# Altium schematic sheet usbhub.SchDoc
size 381 x 241 mm; SheetNumber: 1; SheetTotal: 2
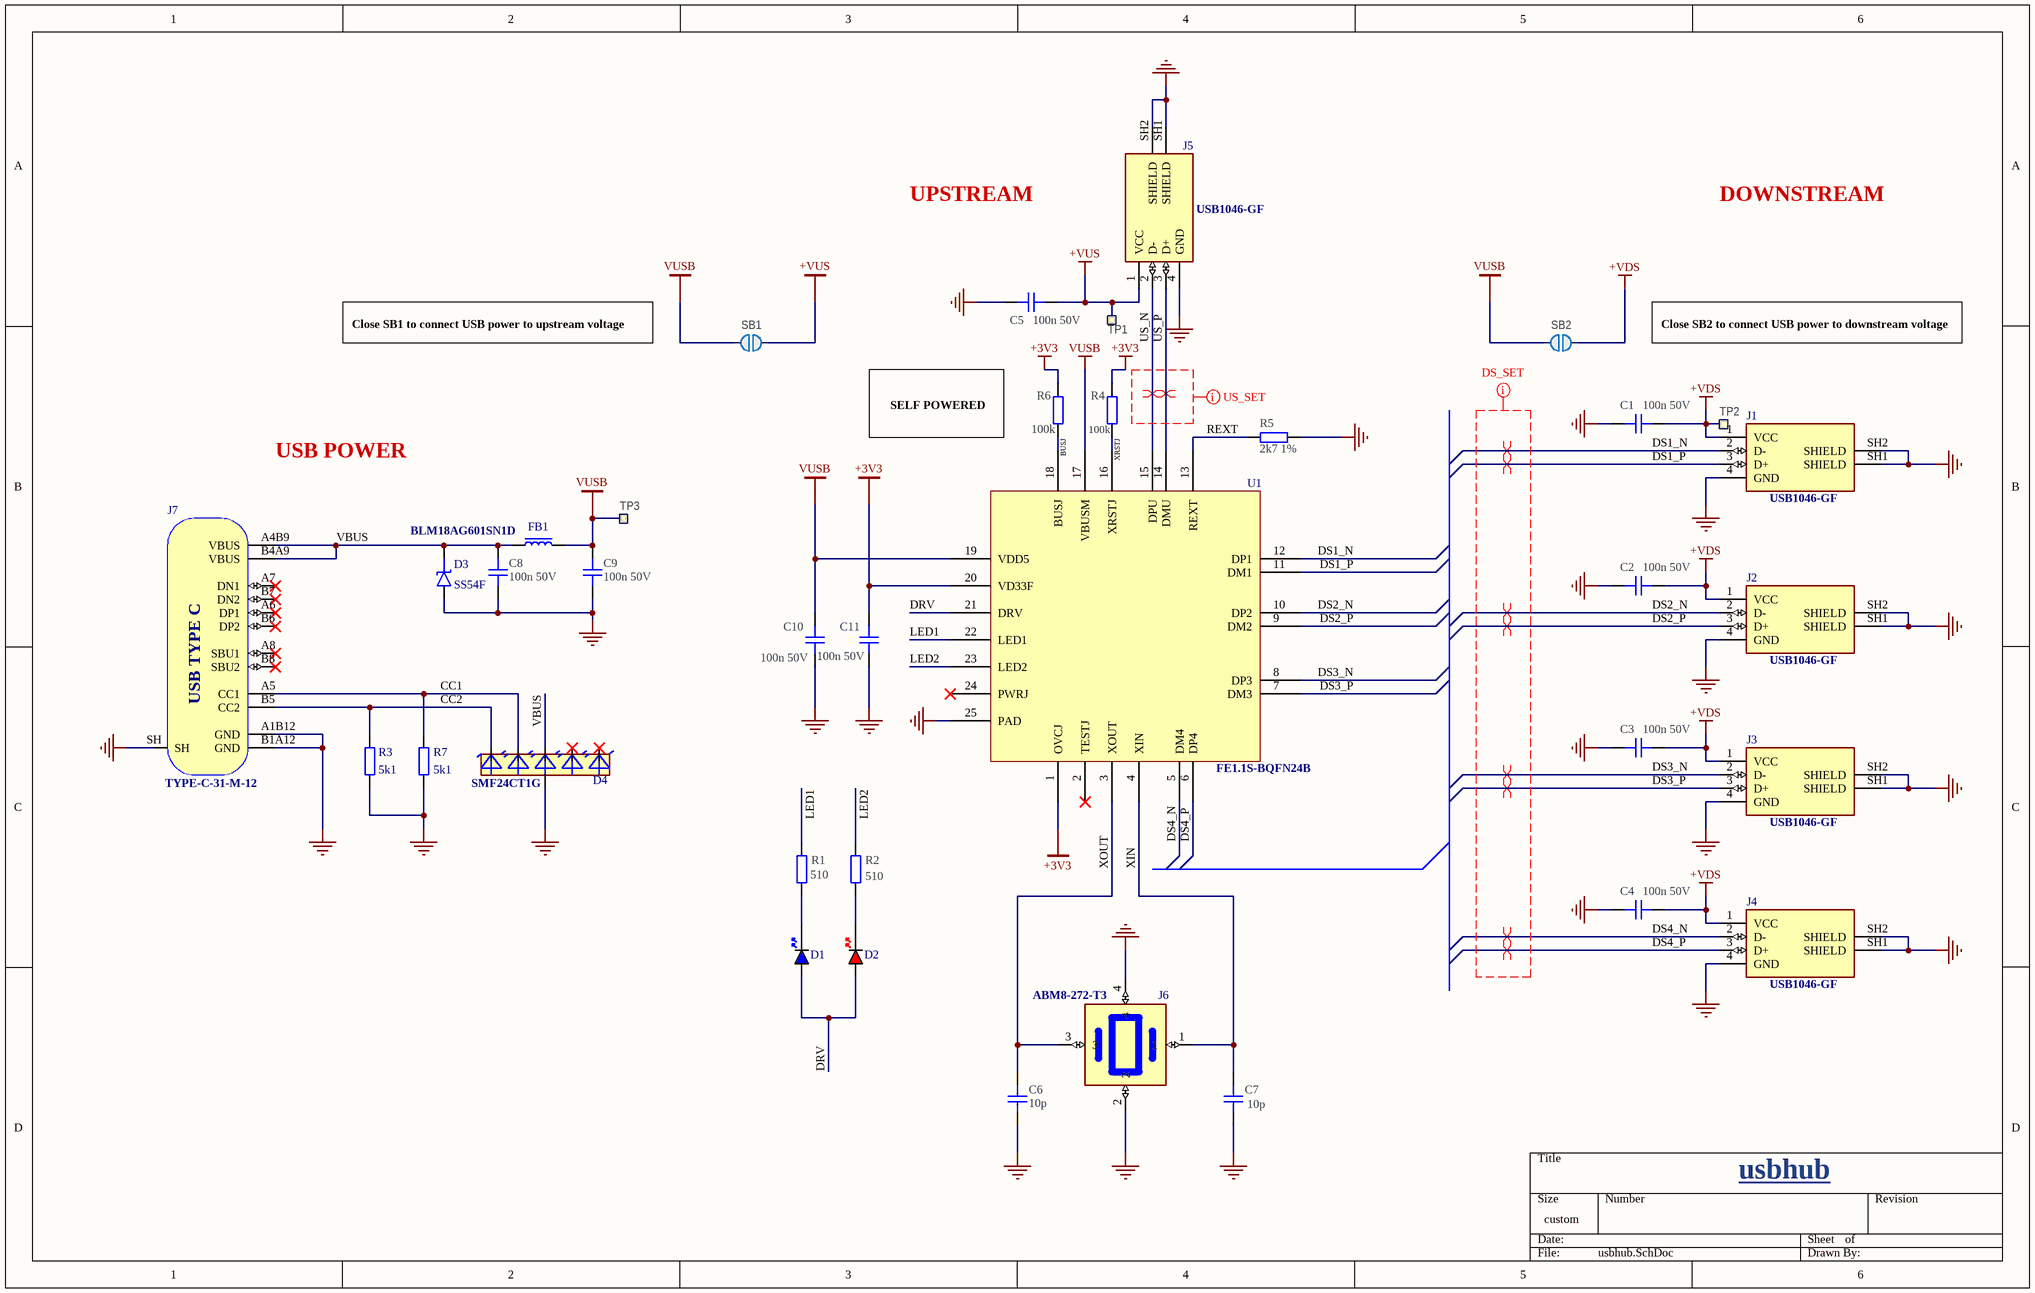
[diagram p0: usbhub.SchDoc]

## Parts
C1  100n 50V  [CAPC1005X04L]
C2  100n 50V  [CAPC1005X04L]
C3  100n 50V  [CAPC1005X04L]
C4  100n 50V  [CAPC1005X04L]
C5  100n 50V  [CAPC1005X04L]
C6  10p  [CAPC1005X04L]
C7  10p  [CAPC1005X04L]
C8  100n 50V  [CAPC1005X04L]
C9  100n 50V  [CAPC1005X04L]
C10  100n 50V  [CAPC1005X04L]
C11  100n 50V  [CAPC1005X04L]
D1  BLUE  [LED_0402_BLUE]  (value not drawn)
D2  RED  [LED_0402_RED]  (value not drawn)
D3  SS54F  [DIOM5226X100N]
D4  SMF24CT1G  [SOT65P210X110-6N]
FB1  BLM18AG601SN1D  [FB_0603]
J1  USB1046-GF  [GCT_USB1046-GF-0190-L-B-A_REVB4]
J2  USB1046-GF  [GCT_USB1046-GF-0190-L-B-A_REVB4]
J3  USB1046-GF  [GCT_USB1046-GF-0190-L-B-A_REVB4]
J4  USB1046-GF  [GCT_USB1046-GF-0190-L-B-A_REVB4]
J5  USB1046-GF  [GCT_USB1046-GF-0190-L-B-A_REVB4]
J6  ABM8-272-T3  [ABM8-272-T3]
J7  TYPE-C-31-M-12  [TYPE-C-31-M-12]
R1  510  [RESC1005X04L]
R2  510  [RESC1005X04L]
R3  5k1  [RES_0603]
R4  100k  [RESC1005X04L]
R5  2k7 1%  [RESC1005X04L]
R6  100k  [RESC1005X04L]
R7  5k1  [RES_0603]
SB1  Solderbridge  [Solderbridge]  (value not drawn)  (no BOM)
SB2  Solderbridge  [Solderbridge]  (value not drawn)  (no BOM)
TP1  Ø1.0mm,SMD  [TP_SMD_D1.0mm]  (value not drawn)  (no BOM)
TP2  Ø1.0mm,SMD  [TP_SMD_D1.0mm]  (value not drawn)  (no BOM)
TP3  Ø1.0mm,SMD  [TP_SMD_D1.0mm]  (value not drawn)  (no BOM)
U1  FE1.1S-BQFN24B  [QFN50P400X400X80-25N]

## Nets
+3V3: C11.2 R4.2 R6.2 U1.1(OVCJ) U1.20(VD33F)
+VDS: C1.2 C2.2 C3.2 C4.2 J1.1(VCC) J2.1(VCC) J3.1(VCC) J4.1(VCC) SB2.1 TP2.1
+VUS: C5.2 J5.1(VCC) SB1.1 TP1.1
GND: C1.1 C2.1 C3.1 C4.1 C5.1 C6.1 C7.1 C8.2 C9.2 C10.1 C11.1 D3.A D4.2(A) J1.4(GND) J1.SH1(SHIELD) J1.SH2(SHIELD) J2.4(GND) J2.SH1(SHIELD) J2.SH2(SHIELD) J3.4(GND) J3.SH1(SHIELD) J3.SH2(SHIELD) J4.4(GND) J4.SH1(SHIELD) J4.SH2(SHIELD) J5.4(GND) J5.SH1(SHIELD) J5.SH2(SHIELD) J6.2 J6.4 J7.A1B12(GND) J7.B1A12(GND) J7.SH R3.1 R5.2 R7.1 U1.25(PAD)
VUSB: C9.1 C10.2 FB1.1 SB1.2 SB2.2 TP3.1 U1.17(VBUSM) U1.19(VDD5)
BUSJ: R6.1 U1.18(BUSJ)
CC1: D4.3(C2) J7.A5(CC1) R7.2
CC2: D4.1(C1) J7.B5(CC2) R3.2
DRV: D1.A D2.A U1.21(DRV)
DS1_N: J1.2(D-) U1.12(DP1)
DS1_P: J1.3(D+) U1.11(DM1)
DS2_N: J2.2(D-) U1.10(DP2)
DS2_P: J2.3(D+) U1.9(DM2)
DS3_N: J3.2(D-) U1.8(DP3)
DS3_P: J3.3(D+) U1.7(DM3)
DS4_N: J4.2(D-) U1.5(DM4)
DS4_P: J4.3(D+) U1.6(DP4)
LED1: R1.2 U1.22(LED1)
LED2: R2.2 U1.23(LED2)
REXT: R5.1 U1.13(REXT)
US_N: J5.2(D-) U1.15(DPU)
US_P: J5.3(D+) U1.14(DMU)
VBUS: C8.1 D3.K D4.4(C3) FB1.2 J7.A4B9(VBUS) J7.B4A9(VBUS)
XIN: C7.2 J6.1 U1.4(XIN)
XOUT: C6.2 J6.3 U1.3(XOUT)
XRSTJ: R4.1 U1.16(XRSTJ)
NetD1_K: D1.K R1.1
NetD2_K: D2.K R2.1

Not connected (* = marked no-connect by the designer): D4 5(C4)* 6(C5)*; J7 A6(DP1)* A7(DN1)* A8(SBU1)* B6(DP2)* B7(DN2)* B8(SBU2)*; U1 2(TESTJ)* 24(PWRJ)*

## Layout directives
mark named DS_SET: (no net found under the mark)
differential pair: DS1_N, DS1_P, DS2_N, DS2_P, DS3_N, DS3_P, DS4_N, DS4_P, US_N, US_P
mark named US_SET: (no net found under the mark)

## Notes on the sheet
- UPSTREAM
- DOWNSTREAM
- Close SB1 to connect USB power to upstream voltage
- Close SB2 to connect USB power to downstream voltage
- SELF POWERED
- USB POWER
- usbhub
- (in symbol TYPE-C-31-M-12) USB TYPE C

## Library data of the parts
C1-C11 = C0402-4µ7: Capacitor, X5R, ±20%; Manufacturer: N.A.; Part number IPS: 00000001251, 00000007165; Part number NEMS: 100200193; Value: 4.7µF; Note: 10V; Artikkelnr Noca: 20039482; Pad Count: 2; Component Status: Active; Part Number: C0402-4µ7; Manufacturer Part Number: N.A.; ComponentLink1URL: N.A.; ComponentLink1Description: Datasheet; ComponentLink2URL: N.A.; ComponentLink2Description: Supplier link; HelpURL: N.A.; Footprint Doc: 0402; LatestRevisionDate: 2017-11-09; Published: 2009-05-08; Supplier 1: Digi-Key; Supplier Part Number 1: 490-13252-1-ND; Supplier 2: N.A.; Supplier Part Number 2: N.A.; PartId: 100200193; Component Class: Capacitors; Author: rsk; Part number Norautron: N.A.
D1 = LED_0402_BLUE: LED 0402 BLUE SMD
D2 = LED_0402_RED: LED 0402 RED SMD
D3 = Schottky Diode_3: Schottky Diode SMD SMAF package
D4 = SMF24CT1G: Quint Uni-Directional TVS Diode, 100W, 6-Pin SC-88 | ON Semiconductor SMF24CT1G; MP: SMF05C; MF: ProTek Devices; Price: None; Availability: In Stock; Package: TSSOP-6 ProTek Devices; SnapEDA_Link: https://www.snapeda.com/parts/SMF05C/Protek+Devices/view-part/?ref=snap; Check_prices: https://www.snapeda.com/parts/SMF05C/Protek+Devices/view-part/?ref=eda; Value: *
FB1 = FB_0603: Ferrite Bead SMD 0603; Manufacturer: *; Manufacturer Part Number: *; Distributor Link: *; LCSC: *
J1-J5 = USB1046-GF-0190-L-B-A_REVB4: USB-A (USB TYPE-A) USB 2.0 Receptacle Connector 4 Position Surface Mount, Through Hole; MF: Global Connector Technology; SnapEDA_Link: https://www.snapeda.com/parts/USB1046-GF-0190-L-B-A/Global+Connector+Technology/view-part/?ref=snap; Package: None; Value: *; MP: USB1046-GF-0190-L-B-A; Check_prices: https://www.snapeda.com/parts/USB1046-GF-0190-L-B-A/Global+Connector+Technology/view-part/?ref=eda
J6 = ABM8-272-T3: 12 MHz Â±30ppm Crystal 10pF 50 Ohms 4-SMD, No Lead; MF: ABRACON; SnapEDA_Link: https://www.snapeda.com/parts/ABM8-272-T3/Abracon/view-part/?ref=snap; Package: SMD-4 Abracon; Value: *; MP: ABM8-272-T3; Check_prices: https://www.snapeda.com/parts/ABM8-272-T3/Abracon/view-part/?ref=eda
J7 = TYPE-C-31-M-12: USB Type C Connector Horizontal SMT; Manufacturer: Koren Hroparts; Manufacturer Part Number: TYPE-C-31-M-12
R1 R2 R4-R6 = R0402-0R: Resistor, ±5%, 0.063W; Manufacturer: N.A.; Part number IPS: 00000007128; Part number NEMS: 100100109; Value: 0R; Note: Chip Res 5%; Artikkelnr Noca: 27049000; Pad Count: 2; Component Status: Active; Part Number: R0402-0R; Manufacturer Part Number: N.A.; ComponentLink1URL: N.A.; ComponentLink1Description: Datasheet; ComponentLink2URL: N.A.; ComponentLink2Description: Supplier link; HelpURL: N.A.; Footprint Doc: 0402; LatestRevisionDate: 2009-11-23; Published: 2009-05-08; Supplier 1: Farnell; Supplier Part Number 1: 146-9661; Supplier 2: N.A.; Supplier Part Number 2: N.A.; PartId: 100100109; Component Class: Resistors; Author: rsk; Part number Norautron: N.A.
R3 R7 = RES_0603: Resistor SMD 0603; Manufacturer: *; Manufacturer Part Number: *; Distributor Link: *; LCSC: *
SB1 SB2 = Solderbridge: Manufacturer: N.A.; Part number NEMS: 100500458; Pad Count: 2; Component Status: Active; System: Connector; Part Number: Solderbridge; Manufacturer Part Number: N.A.; LatestRevisionDate: 2009-12-14; Published: 2009-12-14; Value: Solderbridge; Note: N.A.; Artikkelnr Noca: N.A.; Footprint Doc: Solderbridge; Part number IPS: N.A.; ComponentLink1URL: N.A.; ComponentLink1Description: Datasheet; ComponentLink2URL: N.A.; ComponentLink2Description: Supplier link; HelpURL: N.A.; Supplier 1: N.A.; Supplier Part Number 1: N.A.; Supplier 2: N.A.; Supplier Part Number 2: N.A.; PartId: 100500458; Component Class: Connectors; Author: rsk; Part number Norautron: N.A.
TP1-TP3 = TP_SMD_Ø1.0MM: 1.0mm circular SMD testpad; Manufacturer: Nordic Semiconductor; Manufacturer Part Number: N.A.; Part number NEMS: 100500475; Pad Count: 1; Component Status: Active; Part Number: TP_SMD_Ø1.0MM; ComponentLink1URL: N.A.; ComponentLink1Description: Datasheet; ComponentLink2URL: N.A.; ComponentLink2Description: Supplier link; HelpURL: N.A.; Footprint Doc: TP_SMD_Ø1.0mm; LatestRevisionDate: 2021-03-05; Published: 2013-06-11; Value: Ø1.0mm,SMD; Note: N.A.; Artikkelnr Noca: N.A.; Part number IPS: N.A.; Supplier 1: N.A.; Supplier Part Number 1: N.A.; Supplier 2: N.A.; Supplier Part Number 2: N.A.; PartId: 100500475; Component Class: Connectors; Author: rsk; Part number Norautron: N.A.
U1 = FE1.1S-BQFN24B: USB Hub USB 2.0 WQFN-24 Interface Controllers RoHS